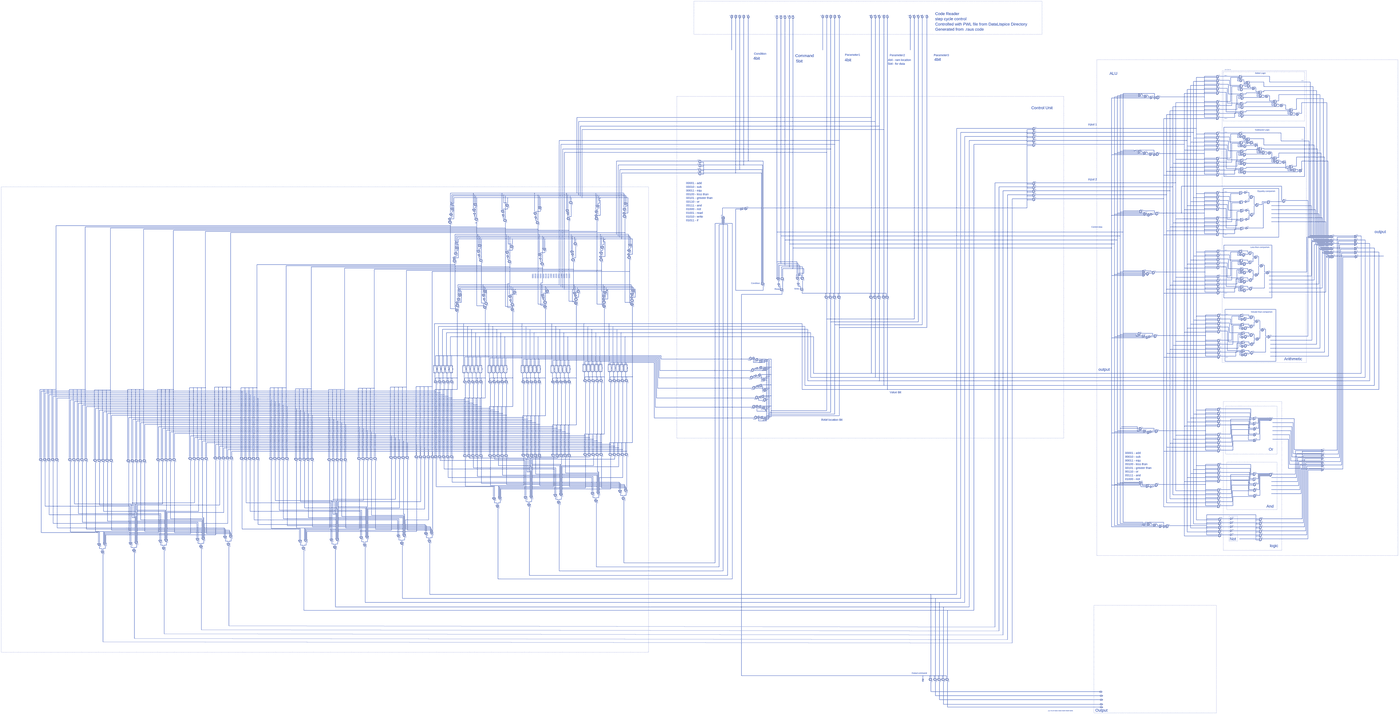
[diagram p0: schematic 4bit processor.asc, whole sheet]
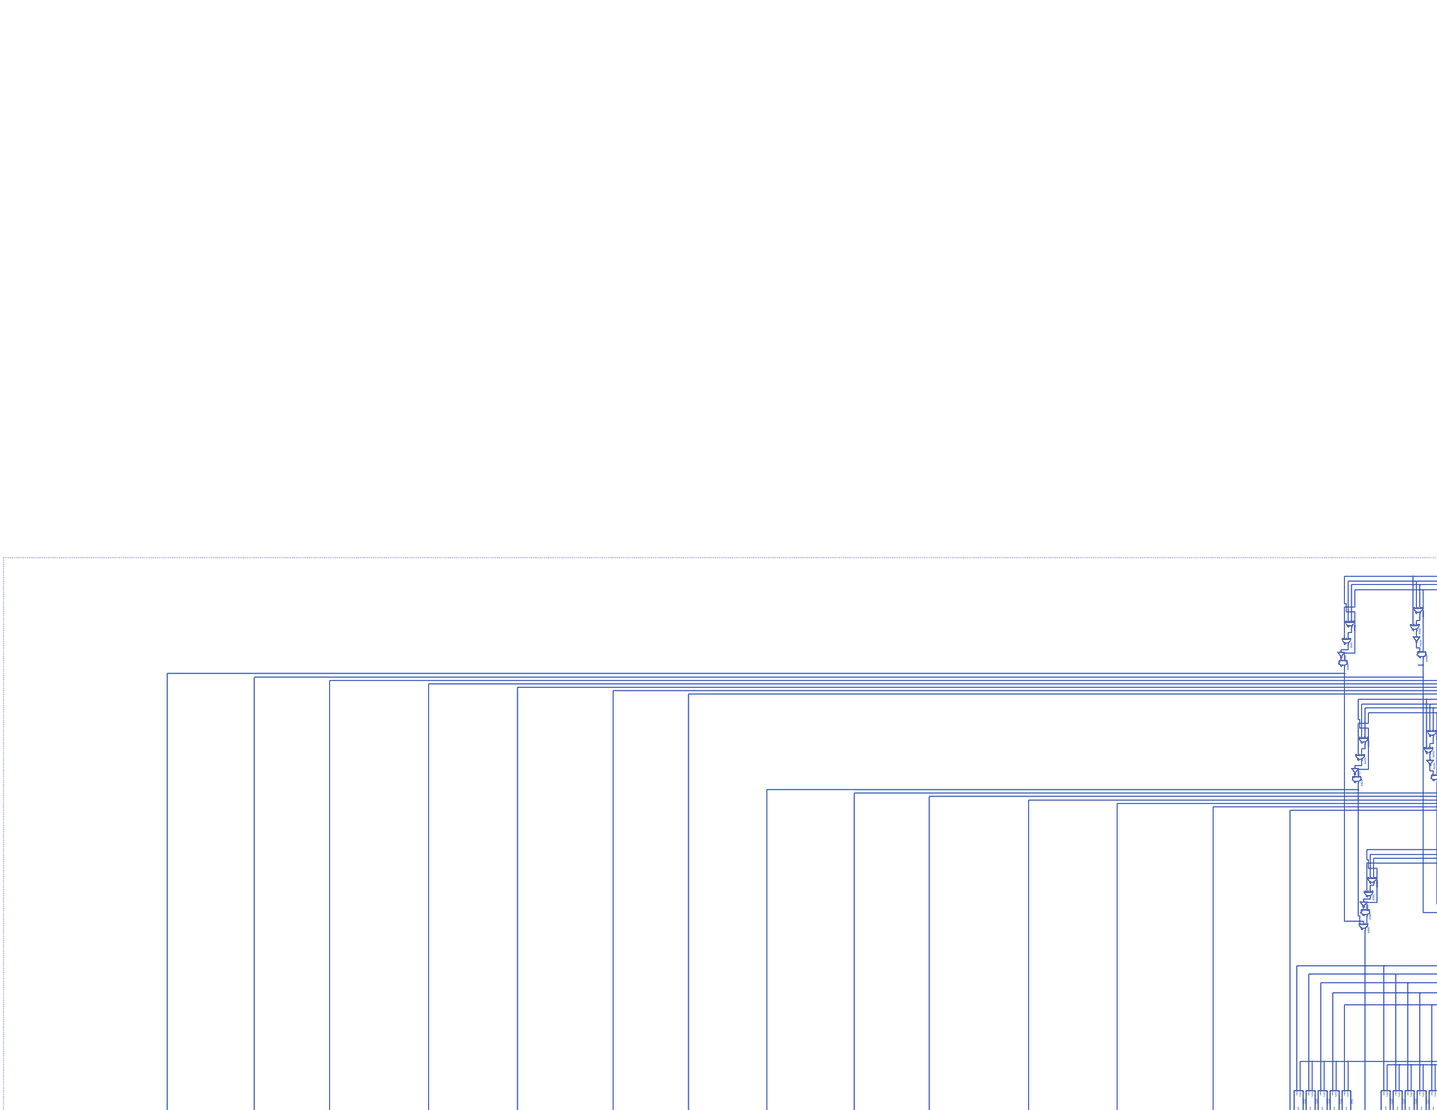
[diagram p1: schematic 4bit processor.asc, part, row 1 of 2, column 1 of 3]
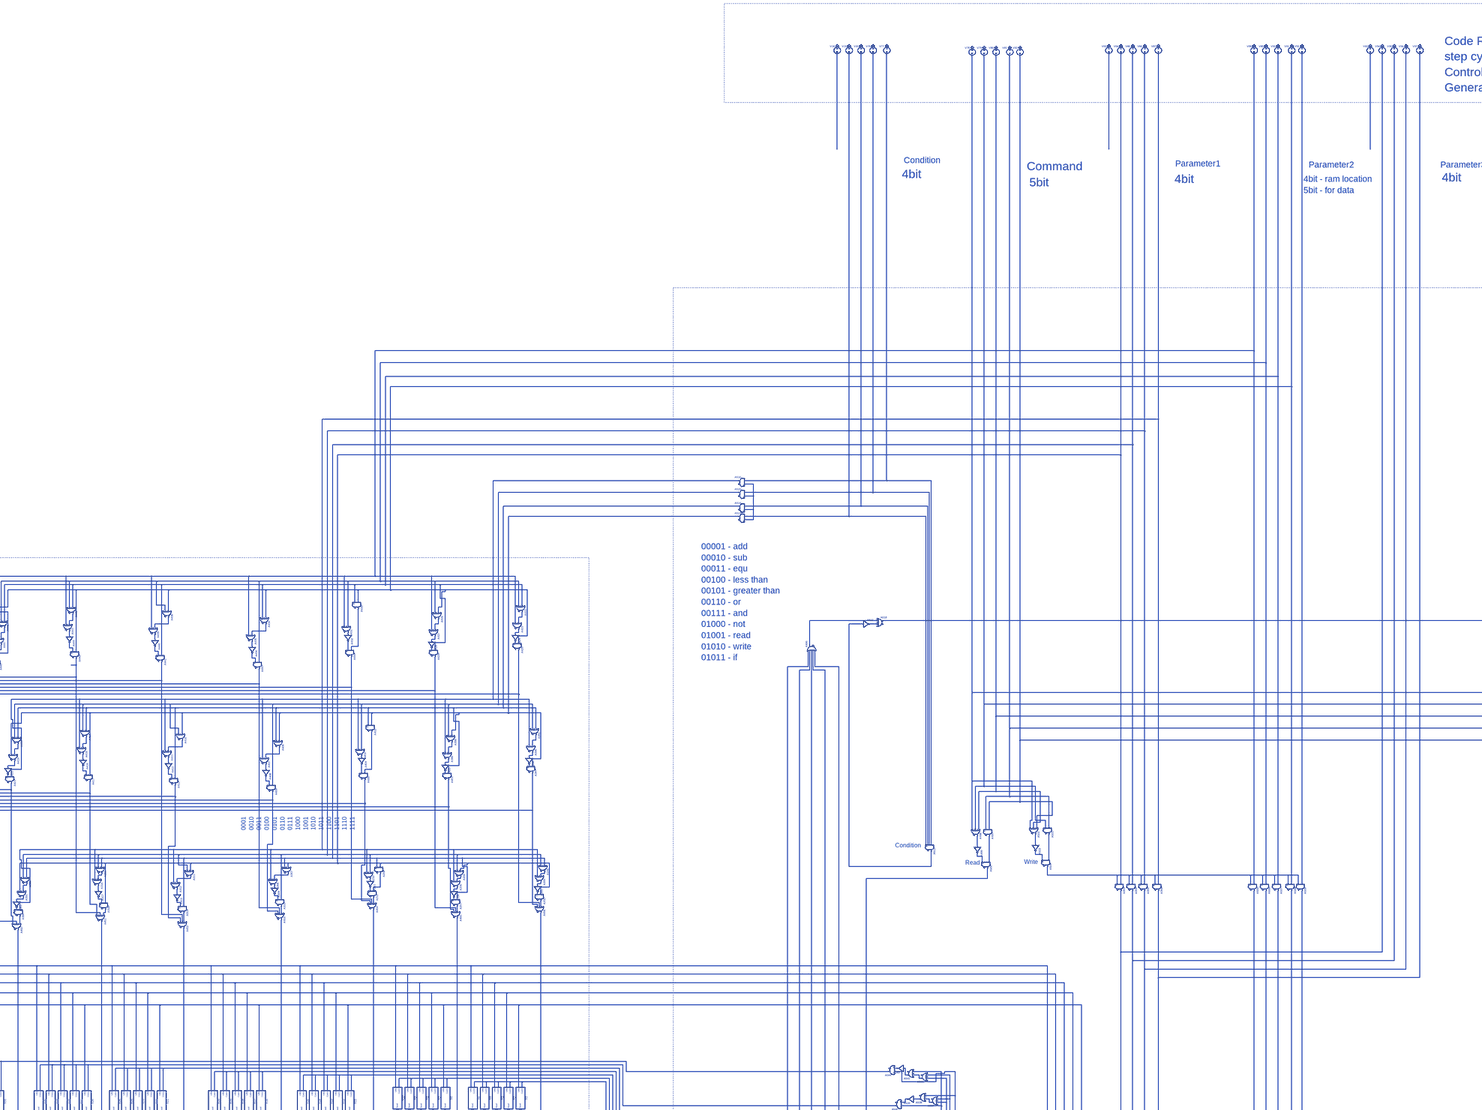
[diagram p2: schematic 4bit processor.asc, part, row 1 of 2, column 2 of 3]
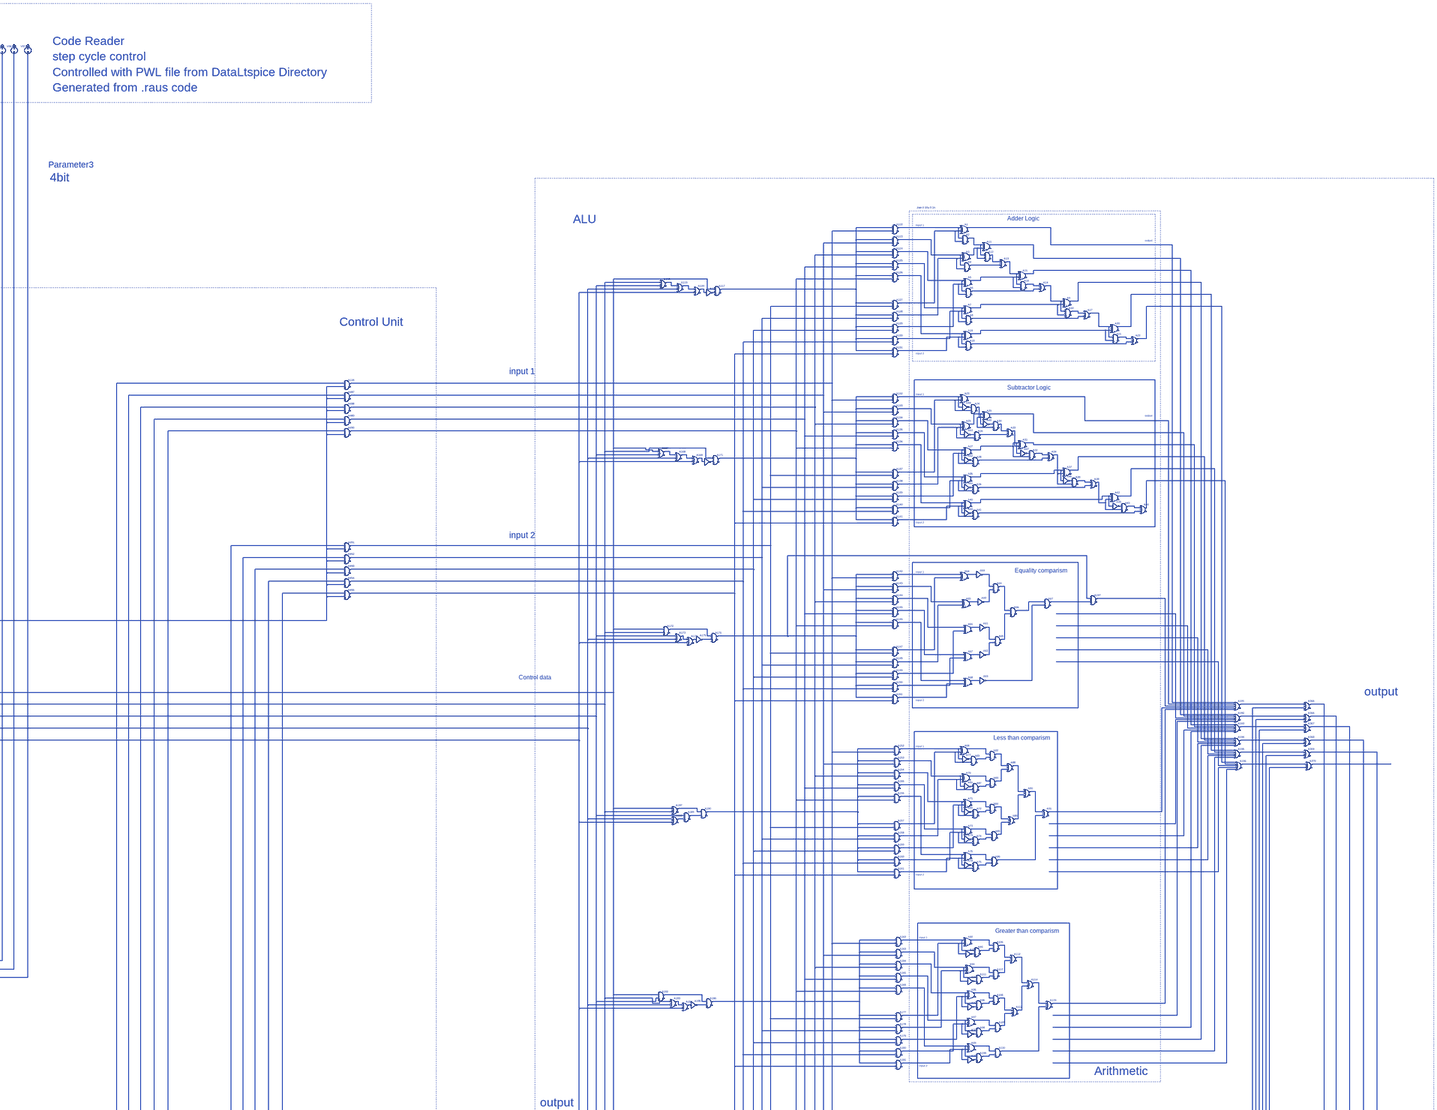
[diagram p3: schematic 4bit processor.asc, part, row 1 of 2, column 3 of 3]
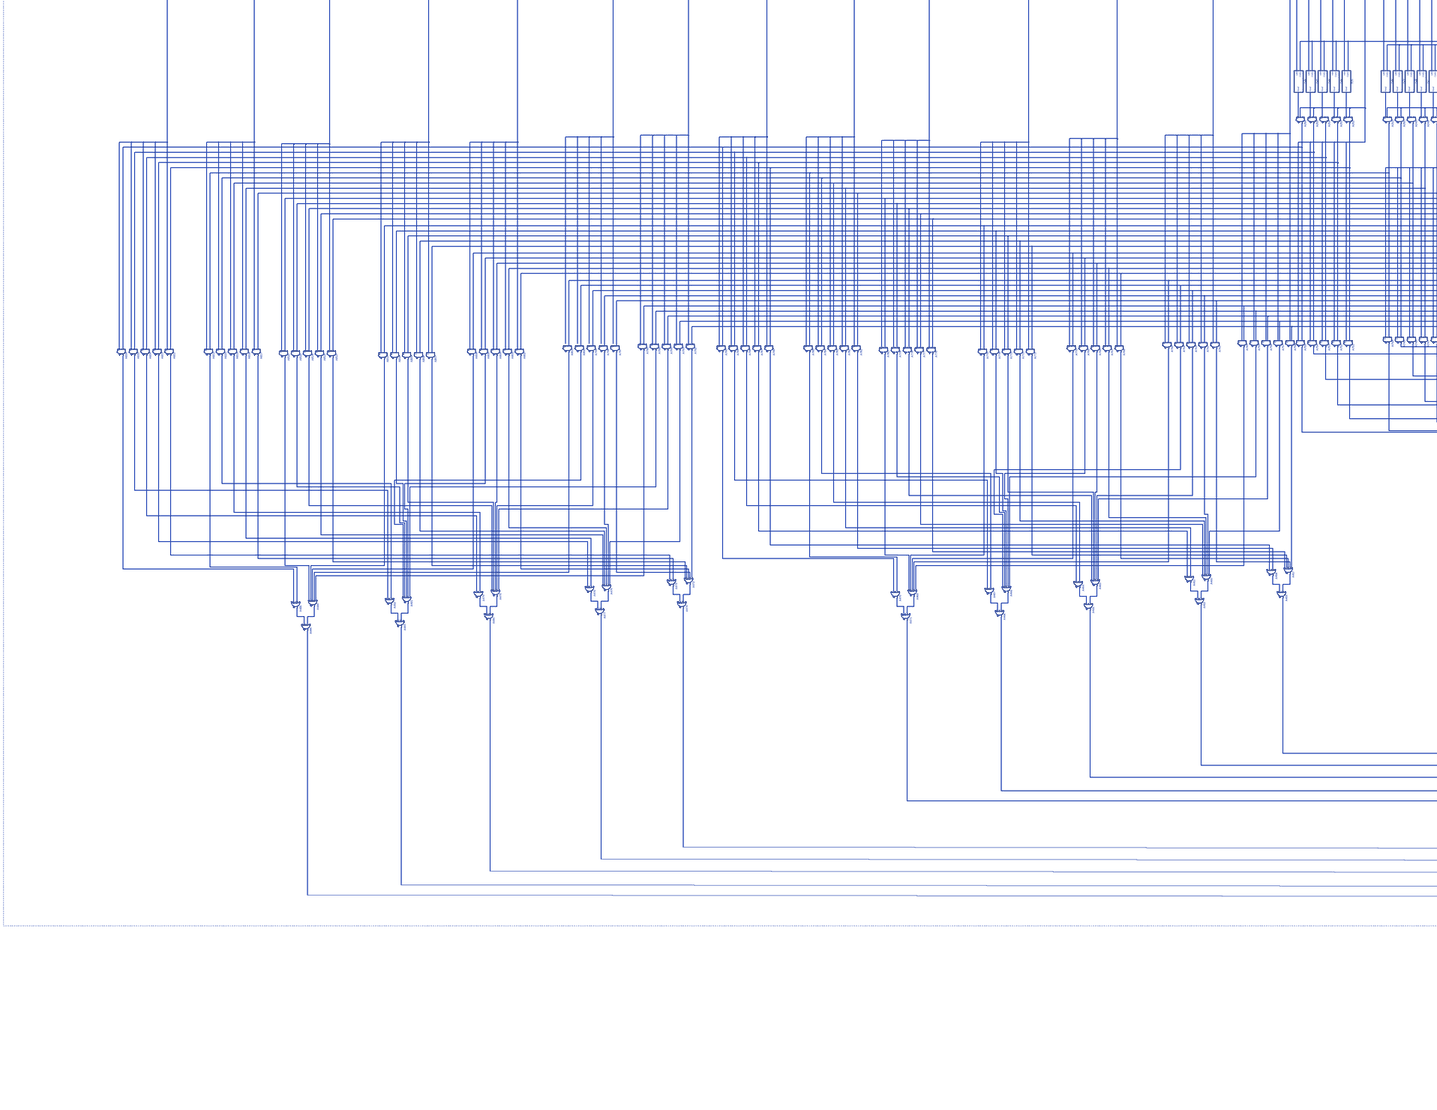
[diagram p4: schematic 4bit processor.asc, part, row 2 of 2, column 1 of 3]
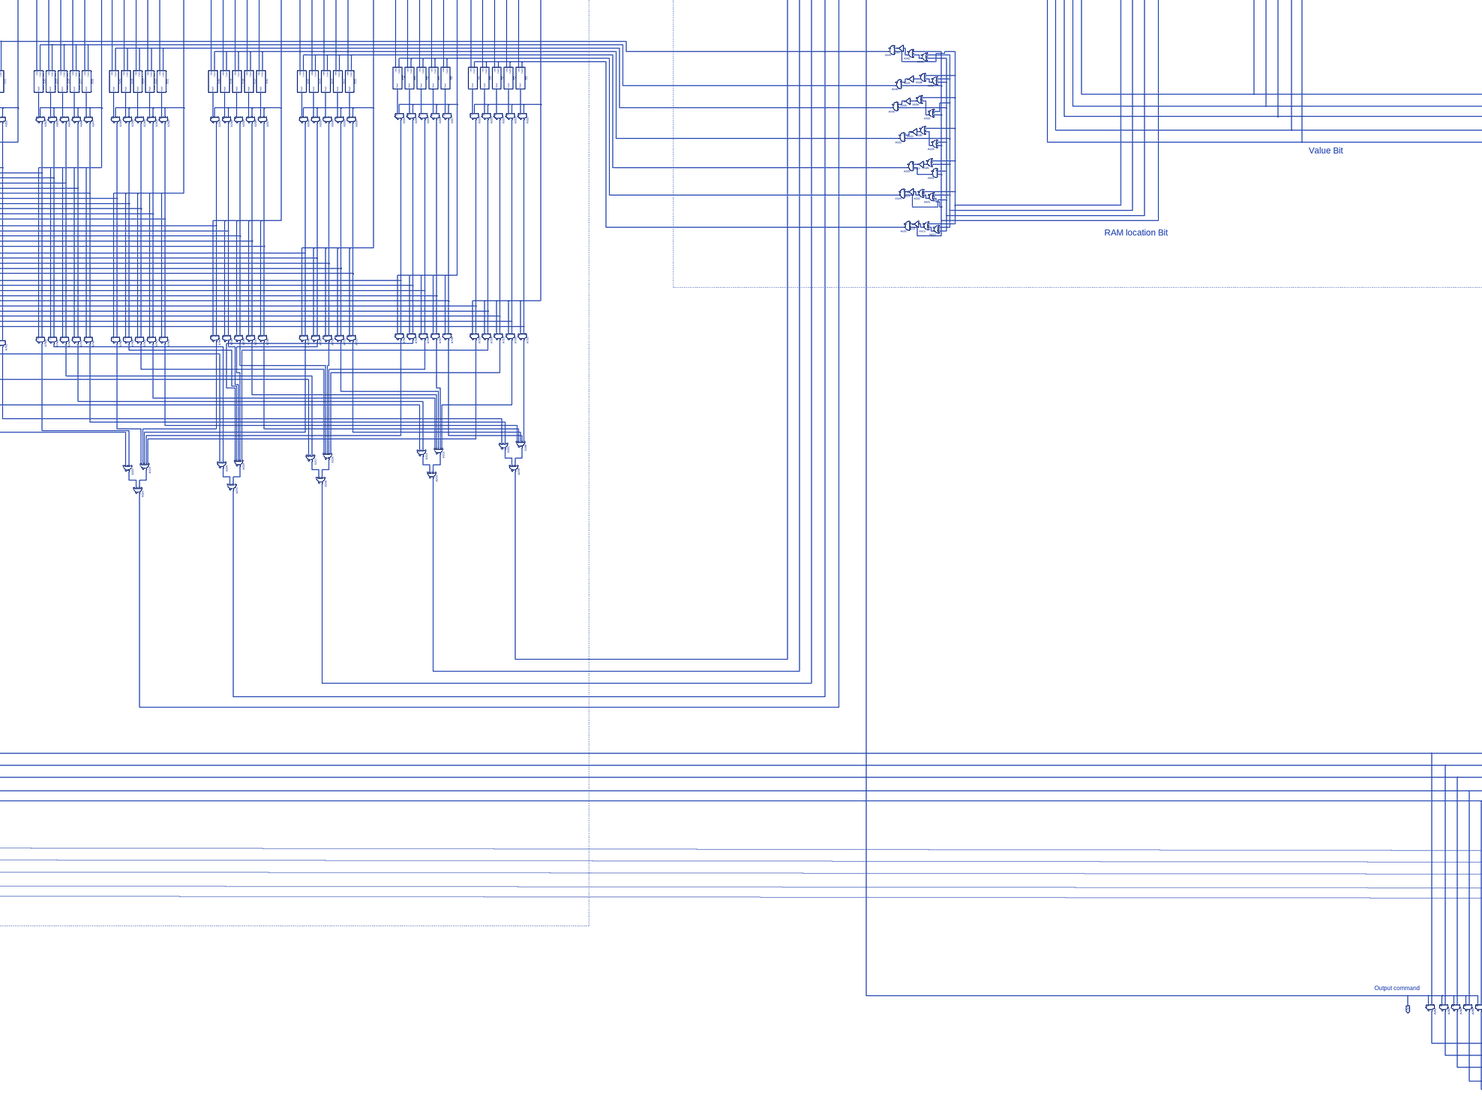
[diagram p5: schematic 4bit processor.asc, part, row 2 of 2, column 2 of 3]
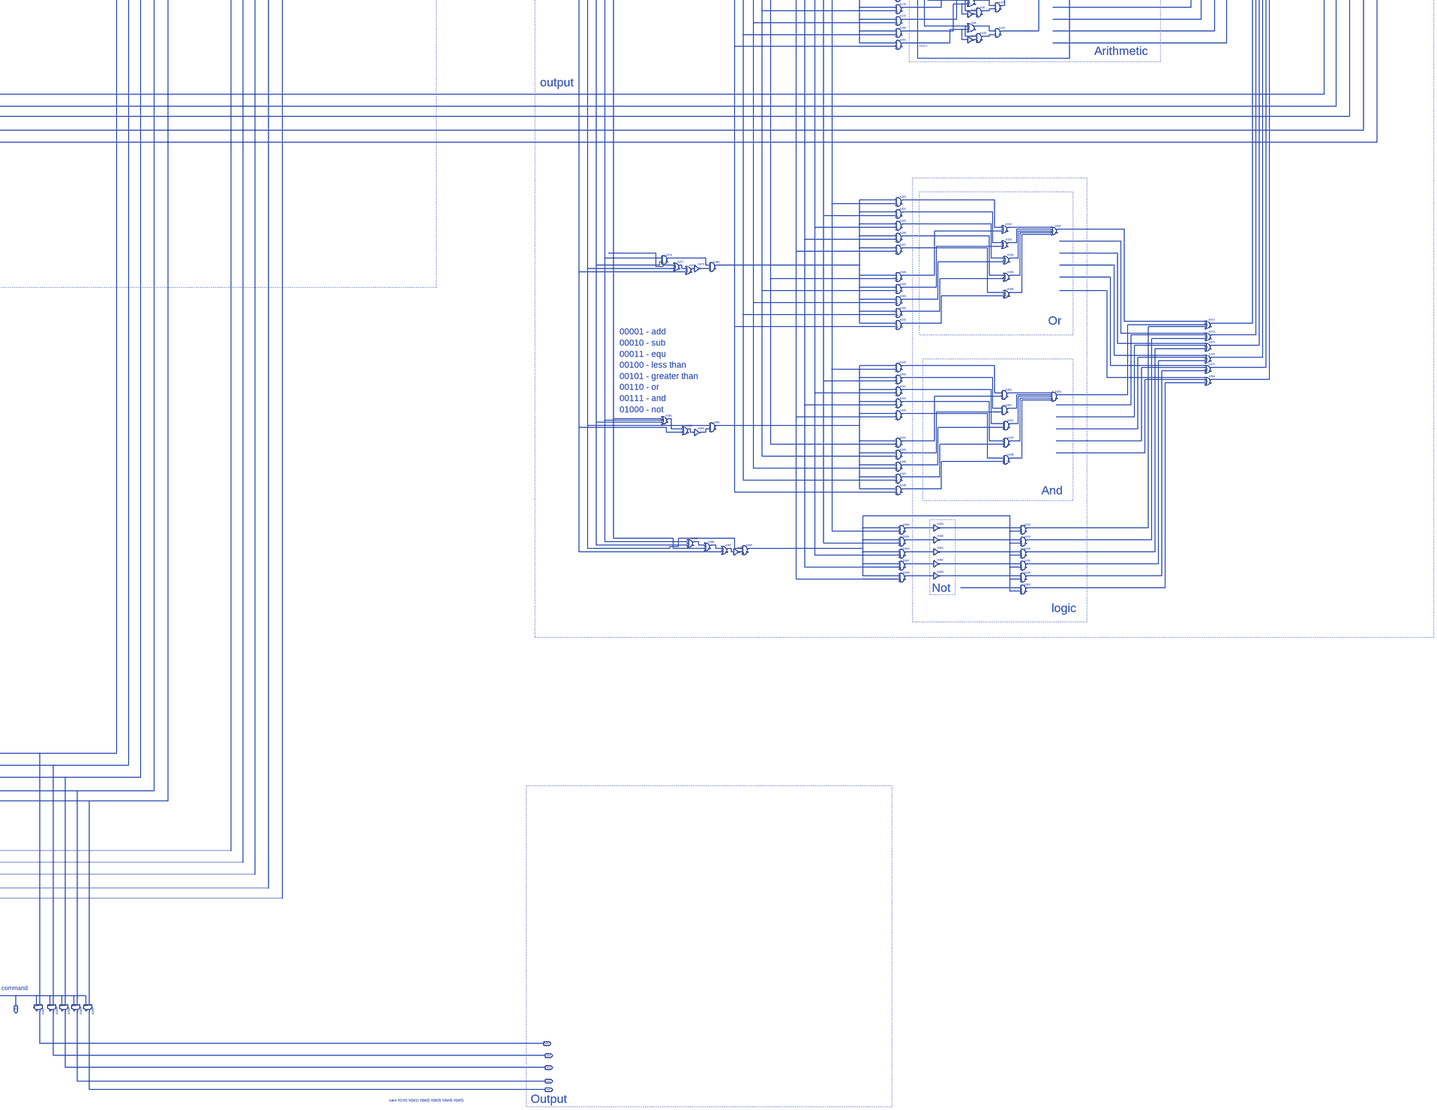
[diagram p6: schematic 4bit processor.asc, part, row 2 of 2, column 3 of 3]
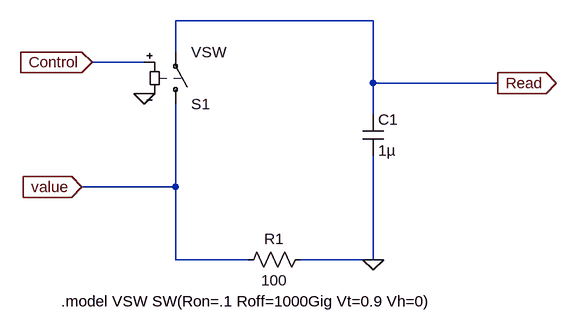
[diagram p7: sub-circuit ram_write_and_read_circuit.asc]
* 4bit processor.asc
A1 0 N005 0 N008 0 0 N006 0 XOR
A2 0 N005 0 N008 0 0 N009 0 AND
A3 0 N010 0 N017 0 0 N013 0 XOR
A4 0 N010 0 N017 0 0 N020 0 AND
A5 0 N014 0 N030 0 0 N024 0 XOR
A6 0 N014 0 N030 0 0 N037 0 AND
A11 0 N009 0 N013 0 0 N012 0 XOR
A12 0 N009 0 N013 0 0 N016 0 AND
A15 0 N018 0 N024 0 0 N022 0 XOR
A16 0 N018 0 N024 0 0 N031 0 AND
A13 0 N016 0 N020 0 0 N018 0 OR
A14 0 N031 0 N037 0 0 N034 0 OR
A7 0 N019 0 N044 0 0 N041 0 XOR
A8 0 N019 0 N044 0 0 N047 0 AND
A9 0 N034 0 N041 0 0 N029 0 XOR
A10 0 N034 0 N041 0 0 N045 0 AND
A17 0 N045 0 N047 0 0 N046 0 OR
A18 0 N023 0 N051 0 0 N050 0 XOR
A19 0 N023 0 N051 0 0 N054 0 AND
A20 0 N046 0 N050 0 0 N040 0 XOR
A21 0 N046 0 N050 0 0 N052 0 AND
A22 0 N052 0 N054 0 0 N043 0 OR
A23 0 N065 0 N067 0 0 N066 0 XOR
A24 0 N069 0 N067 0 0 N070 0 AND
A25 0 N071 0 N079 0 0 N072 0 XOR
A26 0 N084 0 N079 0 0 N085 0 AND
A27 0 N076 0 N091 0 0 N086 0 XOR
A28 0 N100 0 N091 0 0 N099 0 AND
A29 0 N072 0 N070 0 0 N073 0 XOR
A30 0 N077 0 N070 0 0 N078 0 AND
A31 0 N086 0 N082 0 0 N087 0 XOR
A32 0 N092 0 N086 0 0 N093 0 AND
A33 0 N078 0 N085 0 0 N082 0 OR
A34 0 N093 0 N099 0 0 N096 0 OR
A35 0 N083 0 N106 0 0 N103 0 XOR
A36 0 N113 0 N106 0 0 N112 0 AND
A37 0 N103 0 N096 0 0 N097 0 XOR
A38 0 N107 0 N096 0 0 N108 0 AND
A39 0 N108 0 N112 0 0 N110 0 OR
A40 0 N089 0 N119 0 0 N116 0 XOR
A41 0 N123 0 N119 0 0 N122 0 AND
A42 0 N116 0 N110 0 0 N102 0 XOR
A43 0 N120 0 N110 0 0 N121 0 AND
A44 0 N121 0 N122 0 0 N109 0 OR
A45 N116 0 0 0 0 N120 0 0 BUF
A46 N103 0 0 0 0 N107 0 0 BUF
A47 N086 0 0 0 0 N092 0 0 BUF
A48 N072 0 0 0 0 N077 0 0 BUF
A49 N065 0 0 0 0 N069 0 0 BUF
A50 N089 0 0 0 0 N123 0 0 BUF
A51 N083 0 0 0 0 N113 0 0 BUF
A52 N076 0 0 0 0 N100 0 0 BUF
A53 N071 0 0 0 0 N084 0 0 BUF
A54 0 N131 0 N134 0 0 N132 0 XOR
A55 0 N136 0 N145 0 0 N142 0 XOR
A56 0 N140 0 N163 0 0 N159 0 XOR
A57 0 N147 0 N186 0 0 N184 0 XOR
A58 0 N153 0 N198 0 0 N196 0 XOR
A59 N132 0 0 0 0 N133 0 0 BUF
A60 N142 0 0 0 0 N138 0 0 BUF
A61 N159 0 0 0 0 N160 0 0 BUF
A62 N184 0 0 0 0 N175 0 0 BUF
A63 N196 0 0 0 0 N146 0 0 BUF
A64 0 N133 0 N138 0 0 N137 0 AND
A65 0 N160 0 N175 0 0 N148 0 AND
A66 0 N137 0 N148 0 0 N143 0 AND
A67 0 N143 0 N146 0 0 N144 0 AND
A68 0 N229 0 N231 0 0 N230 0 XOR
A69 0 N243 0 N231 0 0 N240 0 AND
A70 0 N244 0 N265 0 0 N264 0 XOR
A71 0 N261 0 N279 0 0 N277 0 XOR
A72 0 N285 0 N279 0 0 N284 0 AND
A73 0 N267 0 N291 0 0 N290 0 XOR
A74 0 N293 0 N291 0 0 N292 0 AND
A75 0 N275 0 N299 0 0 N297 0 XOR
A76 0 N303 0 N299 0 0 N302 0 AND
A77 N229 0 0 0 0 N243 0 0 BUF
A78 N275 0 0 0 0 N303 0 0 BUF
A79 N267 0 0 0 0 N293 0 0 BUF
A80 N261 0 0 0 0 N285 0 0 BUF
A81 N244 0 0 0 0 N269 0 0 BUF
A82 0 N230 0 N240 0 0 N235 0 AND
A83 0 N264 0 N268 0 0 N256 0 AND
A84 0 N277 0 N284 0 0 N281 0 AND
A85 0 N290 0 N292 0 0 N289 0 AND
A86 0 N297 0 N302 0 0 N287 0 AND
A87 0 N269 0 N265 0 0 N268 0 AND
A88 0 N235 0 N256 0 0 N251 0 OR
A89 0 N281 0 N289 0 0 N273 0 OR
A90 0 N251 0 N273 0 0 N271 0 OR
A91 0 N271 0 N287 0 0 N204 0 OR
A92 0 N336 0 N338 0 0 N337 0 XOR
A93 0 N336 0 N343 0 0 N340 0 AND
A94 0 N342 0 N350 0 0 N348 0 XOR
A95 0 N347 0 N360 0 0 N358 0 XOR
A96 0 N347 0 N366 0 0 N363 0 AND
A97 0 N351 0 N370 0 0 N369 0 XOR
A98 0 N351 0 N372 0 0 N371 0 AND
A99 0 N357 0 N374 0 0 N373 0 XOR
A100 0 N357 0 N376 0 0 N375 0 AND
A101 N338 0 0 0 0 N343 0 0 BUF
A102 N374 0 0 0 0 N376 0 0 BUF
A103 N370 0 0 0 0 N372 0 0 BUF
A104 N360 0 0 0 0 N366 0 0 BUF
A105 N350 0 0 0 0 N354 0 0 BUF
A106 0 N337 0 N340 0 0 N339 0 AND
A107 0 N348 0 N352 0 0 N346 0 AND
A108 0 N358 0 N363 0 0 N361 0 AND
A109 0 N369 0 N371 0 0 N368 0 AND
A110 0 N373 0 N375 0 0 N367 0 AND
A111 0 N342 0 N354 0 0 N352 0 AND
A112 0 N339 0 N346 0 0 N344 0 OR
A113 0 N361 0 N368 0 0 N356 0 OR
A114 0 N344 0 N356 0 0 N355 0 OR
A115 0 N355 0 N367 0 0 N206 0 OR
A118 0 N027 0 N032 0 0 N028 0 OR
A119 0 N028 0 N035 0 0 N033 0 OR
A120 0 N033 0 N038 0 0 N036 0 OR
A121 N036 0 0 0 0 N039 0 0 BUF
A122 0 N004 0 N007 0 0 N005 0 AND
A117 0 N025 0 N039 0 0 N004 0 AND
A123 0 N004 0 N011 0 0 N010 0 AND
A124 0 N004 0 N015 0 0 N014 0 AND
A125 0 N004 0 N021 0 0 N019 0 AND
A126 0 N004 0 N026 0 0 N023 0 AND
A127 0 N004 0 N042 0 0 N008 0 AND
A128 0 N004 0 N048 0 0 N017 0 AND
A129 0 N004 0 N049 0 0 N030 0 AND
A130 0 N004 0 N053 0 0 N044 0 AND
A131 0 N004 0 N056 0 0 N051 0 AND
A132 0 N064 0 N007 0 0 N065 0 AND
A133 0 N064 0 N011 0 0 N071 0 AND
A134 0 N064 0 N015 0 0 N076 0 AND
A135 0 N064 0 N021 0 0 N083 0 AND
A136 0 N064 0 N026 0 0 N089 0 AND
A137 0 N064 0 N042 0 0 N067 0 AND
A138 0 N064 0 N048 0 0 N079 0 AND
A139 0 N064 0 N049 0 0 N091 0 AND
A140 0 N064 0 N053 0 0 N106 0 AND
A141 0 N064 0 N056 0 0 N119 0 AND
A142 0 N127 0 N007 0 0 N131 0 AND
A143 0 N127 0 N011 0 0 N136 0 AND
A144 0 N127 0 N015 0 0 N140 0 AND
A145 0 N127 0 N021 0 0 N147 0 AND
A146 0 N127 0 N026 0 0 N153 0 AND
A147 0 N127 0 N042 0 0 N134 0 AND
A148 0 N127 0 N048 0 0 N145 0 AND
A149 0 N127 0 N049 0 0 N163 0 AND
A150 0 N127 0 N053 0 0 N186 0 AND
A151 0 N127 0 N056 0 0 N198 0 AND
A152 0 N228 0 N007 0 0 N229 0 AND
A153 0 N228 0 N011 0 0 N244 0 AND
A154 0 N228 0 N015 0 0 N261 0 AND
A155 0 N228 0 N021 0 0 N267 0 AND
A156 0 N228 0 N026 0 0 N275 0 AND
A157 0 N228 0 N042 0 0 N231 0 AND
A158 0 N228 0 N048 0 0 N265 0 AND
A159 0 N228 0 N049 0 0 N279 0 AND
A160 0 N228 0 N053 0 0 N291 0 AND
A161 0 N228 0 N056 0 0 N299 0 AND
A162 0 N335 0 N007 0 0 N336 0 AND
A163 0 N335 0 N011 0 0 N342 0 AND
A164 0 N335 0 N015 0 0 N347 0 AND
A165 0 N335 0 N021 0 0 N351 0 AND
A166 0 N335 0 N026 0 0 N357 0 AND
A167 0 N025 0 N032 0 0 N090 0 OR
A168 0 N090 0 N035 0 0 N095 0 OR
A169 0 N095 0 N038 0 0 N098 0 OR
A170 N098 0 0 0 0 N101 0 0 BUF
A171 0 N027 0 N101 0 0 N064 0 AND
A172 0 N025 0 N027 0 0 N161 0 AND
A173 0 N032 0 N035 0 0 N168 0 OR
A174 0 N168 0 N038 0 0 N172 0 OR
A175 N172 0 0 0 0 N173 0 0 BUF
A176 0 N161 0 N173 0 0 N127 0 AND
A177 0 N335 0 N042 0 0 N338 0 AND
A178 0 N335 0 N048 0 0 N350 0 AND
A179 0 N335 0 N049 0 0 N360 0 AND
A180 0 N335 0 N053 0 0 N370 0 AND
A181 0 N335 0 N056 0 0 N374 0 AND
A182 0 N025 0 N032 0 0 N359 0 AND
A183 0 N027 0 N035 0 0 N362 0 OR
A184 0 N362 0 N038 0 0 N364 0 OR
A185 N364 0 0 0 0 N365 0 0 BUF
A186 0 N359 0 N365 0 0 N335 0 AND
A187 0 N025 0 N027 0 0 N282 0 OR
A188 0 N035 0 N038 0 0 N288 0 OR
A189 0 N032 0 N288 0 0 N286 0 AND
A190 0 N282 0 N286 0 0 N228 0 AND
A191 N006 N066 N141 N204 N206 0 N202 0 OR
A192 N012 N073 N149 N209 N211 0 N207 0 OR
A193 N022 N087 N158 N214 N217 0 N212 0 OR
A194 N029 N097 N169 N222 N224 0 N219 0 OR
A195 N040 N102 N182 N237 N241 0 N232 0 OR
A196 N043 N109 N188 N252 N257 0 N247 0 OR
A197 0 N127 0 N144 0 0 N141 0 AND
A199 0 N088 0 N080 0 0 N304 0 OR
A200 0 N304 0 N074 0 0 N311 0 OR
A201 N311 0 0 0 0 N320 0 0 BUF
A202 0 N094 0 N320 0 0 N327 0 AND
A204 0 N094 0 N080 0 0 N309 0 OR
A205 0 N309 0 N074 0 0 N316 0 OR
A206 N316 0 0 0 0 N324 0 0 BUF
A207 0 N088 0 N324 0 0 N329 0 AND
A208 0 N094 0 N088 0 0 N315 0 AND
A210 0 N080 0 N074 0 0 N310 0 OR
A211 N310 0 0 0 0 N318 0 0 BUF
A212 0 N315 0 N318 0 0 N326 0 AND
A222 0 N394 0 N409 0 0 N508 0 AND
A223 0 N394 0 N408 0 0 N506 0 AND
A224 0 0 0 N407 0 0 N505 0 AND
A225 0 N394 0 N406 0 0 N504 0 AND
A226 0 0 N394 N405 0 0 N503 0 AND
A227 0 N393 0 N404 0 0 N502 0 AND
A228 0 N393 0 N403 0 0 N500 0 AND
A229 0 0 0 N402 0 0 N498 0 AND
A230 0 N393 0 N401 0 0 N497 0 AND
A231 0 0 N393 N400 0 0 N496 0 AND
A232 0 N399 0 N434 0 0 N493 0 AND
A233 0 N399 0 N433 0 0 N490 0 AND
A234 0 0 0 N432 0 0 N487 0 AND
A235 0 N399 0 N431 0 0 N484 0 AND
A236 0 0 N399 N430 0 0 N482 0 AND
A237 0 N398 0 N429 0 0 N479 0 AND
A238 0 N398 0 N428 0 0 N477 0 AND
A239 0 0 0 N427 0 0 N475 0 AND
A240 0 N398 0 N426 0 0 N470 0 AND
A241 0 0 N398 N425 0 0 N465 0 AND
A242 0 N397 0 N424 0 0 N461 0 AND
A243 0 N397 0 N423 0 0 N460 0 AND
A244 0 0 0 N422 0 0 N458 0 AND
A245 0 N397 0 N421 0 0 N457 0 AND
A246 0 0 N397 N420 0 0 N454 0 AND
A247 0 N396 0 N419 0 0 N452 0 AND
A248 0 N396 0 N418 0 0 N449 0 AND
A249 0 0 0 N417 0 0 N448 0 AND
A250 0 N396 0 N416 0 0 N447 0 AND
A251 0 0 N396 N415 0 0 N446 0 AND
A252 0 N395 0 N414 0 0 N444 0 AND
A253 0 N395 0 N413 0 0 N441 0 AND
A254 0 0 0 N412 0 0 N440 0 AND
A255 0 N395 0 N411 0 0 N439 0 AND
A256 0 0 N395 N410 0 0 N438 0 AND
A307 0 N094 0 N088 0 0 N306 0 OR
A308 0 N306 0 N074 0 0 N314 0 OR
A309 N314 0 0 0 0 N321 0 0 BUF
A310 0 N080 0 N321 0 0 N331 0 AND
A311 0 N094 0 N080 0 0 N308 0 OR
A312 0 N308 0 N074 0 0 N319 0 OR
A313 N319 0 0 0 0 N325 0 0 BUF
A314 0 N088 0 N325 0 0 N332 0 AND
A315 0 N088 0 N080 0 0 N305 0 OR
A316 0 N305 0 N074 0 0 N317 0 OR
A317 N317 0 0 0 0 N323 0 0 BUF
A318 0 N094 0 N323 0 0 N330 0 AND
A198 N571 N569 N567 N561 N557 0 N574 0 OR
A203 0 N556 0 N554 0 0 N573 0 OR
A209 0 N574 0 N573 0 0 N190 0 OR
A213 N551 N537 N539 N541 N545 0 N577 0 OR
A214 0 N548 0 N550 0 0 N576 0 OR
A215 0 N577 0 N576 0 0 N192 0 OR
A216 N531 N529 N524 N523 N528 0 N580 0 OR
A217 0 N532 0 N534 0 0 N579 0 OR
A218 0 N580 0 N579 0 0 N690 0 OR
A219 N519 N516 N515 N518 N512 0 N587 0 OR
A220 0 N514 0 N520 0 0 N586 0 OR
A221 0 N587 0 N586 0 0 N193 0 OR
A319 N570 N568 N566 N560 N559 0 N591 0 OR
A320 0 N564 0 N565 0 0 N590 0 OR
A321 0 N591 0 N590 0 0 N191 0 OR
A322 0 N456 0 N471 0 0 N467 0 OR
A323 0 N455 0 N007 0 0 N456 0 AND
A324 0 N455 0 N011 0 0 N459 0 AND
A325 0 N455 0 N015 0 0 N464 0 AND
A326 0 N455 0 N021 0 0 N476 0 AND
A327 0 N455 0 N026 0 0 N481 0 AND
A328 0 N455 0 N042 0 0 N471 0 AND
A329 0 N455 0 N048 0 0 N480 0 AND
A330 0 N455 0 N049 0 0 N486 0 AND
A331 0 N455 0 N053 0 0 N495 0 AND
A332 0 N455 0 N056 0 0 N501 0 AND
A333 0 N459 0 N480 0 0 N468 0 OR
A334 0 N464 0 N486 0 0 N472 0 OR
A335 0 N476 0 N495 0 0 N473 0 OR
A336 0 N481 0 N501 0 0 N474 0 OR
A337 N467 N468 N472 N473 N474 0 N469 0 OR
A339 0 N525 0 N007 0 0 N526 0 AND
A340 0 N525 0 N011 0 0 N533 0 AND
A341 0 N525 0 N015 0 0 N538 0 AND
A342 0 N525 0 N021 0 0 N549 0 AND
A343 0 N525 0 N026 0 0 N553 0 AND
A344 0 N525 0 N042 0 0 N543 0 AND
A345 0 N525 0 N048 0 0 N552 0 AND
A346 0 N525 0 N049 0 0 N558 0 AND
A347 0 N525 0 N053 0 0 N572 0 AND
A348 0 N525 0 N056 0 0 N575 0 AND
A354 0 N613 0 N007 0 0 N620 0 AND
A355 0 N613 0 N011 0 0 N627 0 AND
A356 0 N613 0 N015 0 0 N638 0 AND
A357 0 N613 0 N021 0 0 N652 0 AND
A358 0 N613 0 N026 0 0 N666 0 AND
A359 N620 0 0 0 0 N621 0 0 BUF
A360 N627 0 0 0 0 N628 0 0 BUF
A361 N638 0 0 0 0 N639 0 0 BUF
A362 N652 0 0 0 0 N653 0 0 BUF
A363 N666 0 0 0 0 N667 0 0 BUF
A338 0 N553 0 N575 0 0 N547 0 AND
A349 0 N549 0 N572 0 0 N546 0 AND
A350 0 N538 0 N558 0 0 N544 0 AND
A351 0 N533 0 N552 0 0 N542 0 AND
A352 0 N526 0 N543 0 0 N540 0 AND
A353 N540 N542 N544 N546 N547 0 N507 0 AND
A365 0 N202 0 N205 0 0 N203 0 OR
A366 0 N207 0 N210 0 0 N208 0 OR
A367 0 N212 0 N215 0 0 N213 0 OR
A368 0 N219 0 N223 0 0 N220 0 OR
A369 0 N232 0 N238 0 0 N233 0 OR
A370 0 N247 0 N253 0 0 N248 0 OR
A371 N469 0 N507 N509 0 0 N205 0 OR
A372 N478 N510 0 N511 0 0 N210 0 OR
A373 N483 N513 0 N517 0 0 N215 0 OR
A374 N489 N521 0 N522 0 0 N223 0 OR
A375 N494 N527 0 N530 0 0 N238 0 OR
A364 N499 N535 0 N536 0 0 N253 0 OR
A376 0 N027 0 N032 0 0 N485 0 AND
A377 0 N025 0 N035 0 0 N488 0 OR
A378 0 N488 0 N038 0 0 N491 0 OR
A379 N491 0 0 0 0 N492 0 0 BUF
A380 0 N485 0 N492 0 0 N455 0 AND
A382 0 N555 0 N038 0 0 N562 0 OR
A384 N562 0 0 0 0 N563 0 0 BUF
A385 0 N035 0 N563 0 0 N525 0 AND
A381 0 N025 N027 N032 0 0 N555 0 OR
A383 0 N027 0 N032 0 0 N631 0 OR
A386 0 N631 0 N025 0 0 N633 0 OR
A387 0 N633 0 N038 0 0 N635 0 OR
A388 N635 0 0 0 0 N637 0 0 BUF
A389 0 N035 0 N637 0 0 N613 0 AND
A390 0 N088 0 N080 0 0 N313 0 OR
A391 0 N313 0 N094 0 0 N322 0 OR
A393 N322 0 0 0 0 N328 0 0 BUF
A394 0 N074 0 N328 0 0 N333 0 AND
A392 0 N117 0 N114 0 0 N218 0 OR
A395 0 N218 0 N104 0 0 N236 0 OR
A396 N236 0 0 0 0 N250 0 0 BUF
A397 0 N124 0 N250 0 0 N283 0 AND
A398 0 N124 0 N114 0 0 N226 0 OR
A399 0 N226 0 N104 0 0 N246 0 OR
A400 N246 0 0 0 0 N260 0 0 BUF
A401 0 N117 0 N260 0 0 N280 0 AND
A402 0 N124 0 N117 0 0 N255 0 AND
A403 0 N114 0 N104 0 0 N239 0 OR
A404 N239 0 0 0 0 N259 0 0 BUF
A405 0 N255 0 N259 0 0 N278 0 AND
A406 0 N124 0 N117 0 0 N234 0 OR
A407 0 N234 0 N104 0 0 N254 0 OR
A408 N254 0 0 0 0 N266 0 0 BUF
A409 0 N114 0 N266 0 0 N276 0 AND
A410 0 N124 0 N114 0 0 N225 0 OR
A411 0 N225 0 N104 0 0 N245 0 OR
A412 N245 0 0 0 0 N262 0 0 BUF
A413 0 N117 0 N262 0 0 N274 0 AND
A414 0 N117 0 N114 0 0 N221 0 OR
A415 0 N221 0 N104 0 0 N242 0 OR
A416 N242 0 0 0 0 N258 0 0 BUF
A417 0 N124 0 N258 0 0 N272 0 AND
A418 0 N117 0 N114 0 0 N227 0 OR
A419 0 N227 0 N124 0 0 N249 0 OR
A420 N249 0 0 0 0 N263 0 0 BUF
A421 0 N104 0 N263 0 0 N270 0 AND
A422 0 N058 0 N057 0 0 N150 0 OR
A423 0 N150 0 N055 0 0 N165 0 OR
A424 N165 0 0 0 0 N174 0 0 BUF
A425 0 N061 0 N174 0 0 N201 0 AND
A426 0 N061 0 N057 0 0 N155 0 OR
A427 0 N155 0 N055 0 0 N171 0 OR
A428 N171 0 0 0 0 N181 0 0 BUF
A429 0 N058 0 N181 0 0 N200 0 AND
A430 0 N061 0 N058 0 0 N177 0 AND
A431 0 N057 0 N055 0 0 N166 0 OR
A432 N166 0 0 0 0 N180 0 0 BUF
A433 0 N177 0 N180 0 0 N199 0 AND
A434 0 N061 0 N058 0 0 N162 0 OR
A435 0 N162 0 N055 0 0 N176 0 OR
A436 N176 0 0 0 0 N185 0 0 BUF
A437 0 N057 0 N185 0 0 N197 0 AND
A438 0 N061 0 N057 0 0 N154 0 OR
A439 0 N154 0 N055 0 0 N170 0 OR
A440 N170 0 0 0 0 N183 0 0 BUF
A441 0 N058 0 N183 0 0 N195 0 AND
A442 0 N058 0 N057 0 0 N151 0 OR
A443 0 N151 0 N055 0 0 N167 0 OR
A444 N167 0 0 0 0 N178 0 0 BUF
A445 0 N061 0 N178 0 0 N189 0 AND
A446 0 N058 0 N057 0 0 N164 0 OR
A447 0 N164 0 N061 0 0 N179 0 OR
A448 N179 0 0 0 0 N187 0 0 BUF
A449 0 N055 0 N187 0 0 N194 0 AND
A450 N333 0 N194 0 N270 0 N395 0 OR
A451 N330 0 N189 0 N272 0 N396 0 OR
A452 0 N332 N195 N274 0 0 N397 0 OR
A453 0 N331 N197 N276 0 0 N398 0 OR
A454 0 N326 N199 N278 0 0 N399 0 OR
A455 0 N329 N200 N280 0 0 N393 0 OR
A456 0 N327 N201 N283 0 0 N394 0 OR
A457 N659 N651 N648 N643 N636 0 N670 0 OR
A458 0 N634 0 N632 0 0 N669 0 OR
A459 0 N670 0 N669 0 0 N060 0 OR
A460 N624 N611 N614 N615 N617 0 N673 0 OR
A461 0 N619 0 N623 0 0 N672 0 OR
A462 0 N673 0 N672 0 0 N063 0 OR
A463 N602 N601 N599 N598 N600 0 N677 0 OR
A464 0 N605 0 N608 0 0 N676 0 OR
A465 0 N677 0 N676 0 0 N068 0 OR
A466 N585 N583 N582 N584 N578 0 N681 0 OR
A467 0 N581 0 N589 0 0 N680 0 OR
A468 0 N681 0 N680 0 0 N075 0 OR
A469 N657 N650 N647 N642 N641 0 N685 0 OR
A470 0 N644 0 N646 0 0 N684 0 OR
A471 0 N685 0 N684 0 0 N081 0 OR
A472 N668 N664 N662 N656 N649 0 N675 0 OR
A473 0 N645 0 N640 0 0 N674 0 OR
A474 0 N675 0 N674 0 0 N126 0 OR
A475 N630 N616 N618 N622 N625 0 N679 0 OR
A476 0 N626 0 N629 0 0 N678 0 OR
A477 0 N679 0 N678 0 0 N128 0 OR
A478 N609 N607 N604 N603 N606 0 N683 0 OR
A479 0 N610 0 N612 0 0 N682 0 OR
A480 0 N683 0 N682 0 0 N130 0 OR
A481 N596 N594 N593 N595 N588 0 N687 0 OR
A482 0 N592 0 N597 0 0 N686 0 OR
A483 0 N687 0 N686 0 0 N135 0 OR
A484 N665 N663 N661 N655 N654 0 N689 0 OR
A485 0 N658 0 N660 0 0 N688 0 OR
A486 0 N689 0 N688 0 0 N139 0 OR
A721 0 N508 0 N394 0 0 N571 0 AND
A722 0 N506 0 N394 0 0 N551 0 AND
A723 0 N505 0 N394 0 0 N531 0 AND
A724 0 N504 0 N394 0 0 N519 0 AND
A725 0 N503 0 N394 0 0 N570 0 AND
A726 0 N502 0 N393 0 0 N569 0 AND
A727 0 N500 0 N393 0 0 N537 0 AND
A728 0 N498 0 N393 0 0 N529 0 AND
A729 0 N497 0 N393 0 0 N512 0 AND
A730 0 N496 0 N393 0 0 N568 0 AND
A731 0 N493 0 N399 0 0 N567 0 AND
A732 0 N490 0 N399 0 0 N539 0 AND
A733 0 N487 0 N399 0 0 N524 0 AND
A734 0 N484 0 N399 0 0 N516 0 AND
A735 0 N482 0 N399 0 0 N566 0 AND
A736 0 N479 0 N398 0 0 N561 0 AND
A737 0 N477 0 N398 0 0 N541 0 AND
A738 0 N475 0 N398 0 0 N523 0 AND
A739 0 N470 0 N398 0 0 N515 0 AND
A740 0 N465 0 N398 0 0 N560 0 AND
A741 0 N461 0 N397 0 0 N557 0 AND
A742 0 N460 0 N397 0 0 N545 0 AND
A743 0 N458 0 N397 0 0 N528 0 AND
A744 0 N457 0 N397 0 0 N518 0 AND
A745 0 N454 0 N397 0 0 N559 0 AND
A746 0 N452 0 N396 0 0 N556 0 AND
A747 0 N449 0 N396 0 0 N548 0 AND
A748 0 N448 0 N396 0 0 N532 0 AND
A749 0 N447 0 N396 0 0 N514 0 AND
A750 0 N446 0 N396 0 0 N564 0 AND
A751 0 N444 0 N395 0 0 N554 0 AND
A752 0 N441 0 N395 0 0 N550 0 AND
A753 0 N440 0 N395 0 0 N534 0 AND
A754 0 N439 0 N395 0 0 N520 0 AND
A755 0 N438 0 N395 0 0 N565 0 AND
A756 0 N508 N283 0 0 0 N659 0 AND
A757 0 N506 N283 0 0 0 N624 0 AND
A758 0 N505 N283 0 0 0 N602 0 AND
A759 0 N504 N283 0 0 0 N585 0 AND
A760 0 N503 N283 0 0 0 N657 0 AND
A761 0 N502 0 N280 0 0 N651 0 AND
A762 0 N500 0 N280 0 0 N611 0 AND
A763 0 N498 0 N280 0 0 N601 0 AND
A764 0 N497 0 N280 0 0 N578 0 AND
A765 0 N496 0 N280 0 0 N650 0 AND
A766 0 N493 0 N278 0 0 N648 0 AND
A767 0 N490 0 N278 0 0 N614 0 AND
A768 0 N487 0 N278 0 0 N599 0 AND
A769 0 N484 0 N278 0 0 N583 0 AND
A770 0 N482 0 N278 0 0 N647 0 AND
A771 0 N479 0 N276 0 0 N643 0 AND
A772 0 N477 0 N276 0 0 N615 0 AND
A773 0 N475 0 N276 0 0 N598 0 AND
A774 0 N470 0 N276 0 0 N582 0 AND
A775 0 N465 0 N276 0 0 N642 0 AND
A776 0 N461 0 N274 0 0 N636 0 AND
A777 0 N460 0 N274 0 0 N617 0 AND
A778 0 N458 0 N274 0 0 N600 0 AND
A779 0 N457 0 N274 0 0 N584 0 AND
A780 0 N454 0 N274 0 0 N641 0 AND
A781 0 N452 0 N272 0 0 N634 0 AND
A782 0 N449 0 N272 0 0 N619 0 AND
A783 0 N448 0 N272 0 0 N605 0 AND
A784 0 N447 0 N272 0 0 N581 0 AND
A785 0 N446 0 N272 0 0 N644 0 AND
A786 0 N444 0 N270 0 0 N632 0 AND
A787 0 N441 0 N270 0 0 N623 0 AND
A788 0 N440 0 N270 0 0 N608 0 AND
A789 0 N439 0 N270 0 0 N589 0 AND
A790 0 N438 0 N270 0 0 N646 0 AND
A792 0 N508 0 N201 0 0 N668 0 AND
A793 0 N506 0 N201 0 0 N630 0 AND
A794 0 N505 0 N201 0 0 N609 0 AND
A795 0 N504 0 N201 0 0 N596 0 AND
A796 0 N503 0 N201 0 0 N665 0 AND
A797 0 N502 0 0 0 0 N664 0 AND
A798 0 N500 0 0 0 0 N616 0 AND
A799 0 N498 0 0 0 0 N607 0 AND
A800 0 N497 0 0 0 0 N588 0 AND
A801 0 N496 0 0 0 0 N663 0 AND
A802 0 N493 0 N199 0 0 N662 0 AND
A803 0 N490 0 N199 0 0 N618 0 AND
A804 0 N487 0 N199 0 0 N604 0 AND
A805 0 N484 0 N199 0 0 N594 0 AND
A806 0 N482 0 N199 0 0 N661 0 AND
A807 0 N479 0 N197 0 0 N656 0 AND
A808 0 N477 0 N197 0 0 N622 0 AND
A809 0 N475 0 N197 0 0 N603 0 AND
A810 0 N470 0 N197 0 0 N593 0 AND
A811 0 N465 0 N197 0 0 N655 0 AND
A812 0 N461 0 N195 0 0 N649 0 AND
A813 0 N460 0 N195 0 0 N625 0 AND
A814 0 N458 0 N195 0 0 N606 0 AND
A815 0 N457 0 N195 0 0 N595 0 AND
A816 0 N454 0 N195 0 0 N654 0 AND
A817 0 N452 0 N189 0 0 N645 0 AND
A818 0 N449 0 N189 0 0 N626 0 AND
A819 0 N448 0 N189 0 0 N610 0 AND
A820 0 N447 0 N189 0 0 N592 0 AND
A821 0 N446 0 N189 0 0 N658 0 AND
A822 0 N444 0 N194 0 0 N640 0 AND
A823 0 N441 0 N194 0 0 N629 0 AND
A824 0 N440 0 N194 0 0 N612 0 AND
A825 0 N439 0 N194 0 0 N597 0 AND
A826 0 N438 0 N194 0 0 N660 0 AND
A116 0 N060 0 N062 0 0 N007 0 AND
A487 0 N063 0 N062 0 0 N011 0 AND
A488 0 N068 0 N062 0 0 N015 0 AND
A489 0 N075 0 N062 0 0 N021 0 AND
A490 0 N081 0 N062 0 0 N026 0 AND
A491 0 N126 0 N062 0 0 N042 0 AND
A492 0 N128 0 N062 0 0 N048 0 AND
A493 0 N130 0 N062 0 0 N049 0 AND
A494 0 N135 0 N062 0 0 N053 0 AND
A495 0 N139 0 N062 0 0 N056 0 AND
A496 N190 N192 N690 N193 N191 0 N152 0 OR
A497 0 N038 0 N035 0 0 N301 0 AND
A498 N032 0 N027 0 N025 0 N295 0 OR
A499 N295 0 0 0 0 N298 0 0 BUF
A500 N301 0 0 0 N298 0 ctrl 0 AND
A501 0 N035 0 N027 0 0 N300 0 AND
A502 N038 0 N032 0 N025 0 N294 0 OR
A503 N294 0 0 0 0 N296 0 0 BUF
A504 N300 0 0 0 N296 0 N307 0 AND
A282 0 N060 0 ctrl 0 0 bit5 0 AND
A283 0 N063 0 ctrl 0 0 bit4 0 AND
A284 0 N068 0 ctrl 0 0 bit3 0 AND
A285 0 N075 0 ctrl 0 0 bit2 0 AND
A286 0 N081 0 ctrl 0 0 bit1 0 AND
A292 0 N621 0 N613 0 0 N509 0 AND
A293 0 N628 0 N613 0 0 N511 0 AND
A294 0 N639 0 N613 0 0 N517 0 AND
A295 0 N653 0 N613 0 0 N522 0 AND
A296 0 N667 0 N613 0 0 N530 0 AND
A302 0 N671 0 N613 0 0 N536 0 AND
A303 0 N094 0 N307 0 0 N341 0 AND
A304 0 N088 0 N307 0 0 N345 0 AND
A305 0 N080 0 N307 0 0 N349 0 AND
A306 0 N074 0 N307 0 0 N353 0 AND
A505 0 N055 0 N307 0 0 N203 0 AND
A506 0 N057 0 N307 0 0 N208 0 AND
A507 0 N058 0 N307 0 0 N213 0 AND
A508 0 N061 0 N307 0 0 N220 0 AND
A512 0 N105 N115 N118 N125 0 N156 0 AND
A513 0 N125 0 N111 0 0 N124 0 AND
A514 0 N118 0 N111 0 0 N117 0 AND
A515 0 N115 0 N111 0 0 N114 0 AND
A516 0 N105 0 N111 0 0 N104 0 AND
A517 N156 0 0 0 0 N157 0 0 BUF
A518 0 N152 0 N157 0 0 N062 0 OR
A509 0 N312 0 N307 0 0 N233 0 AND
V18 N001 0 PWL file="C:\Users\Angelo Apenkwah\Desktop\Projects\Logic processor\RausLang\DataLtspice\Bit1.txt"
V19 N125 0 PWL file="C:\Users\Angelo Apenkwah\Desktop\Projects\Logic processor\RausLang\DataLtspice\Bit2.txt"
V20 N118 0 PWL file="C:\Users\Angelo Apenkwah\Desktop\Projects\Logic processor\RausLang\DataLtspice\Bit3.txt"
V76 N115 0 PWL file="C:\Users\Angelo Apenkwah\Desktop\Projects\Logic processor\RausLang\DataLtspice\Bit4.txt"
V77 N105 0 PWL file="C:\Users\Angelo Apenkwah\Desktop\Projects\Logic processor\RausLang\DataLtspice\Bit5.txt"
V78 N025 0 PWL file="C:\Users\Angelo Apenkwah\Desktop\Projects\Logic processor\RausLang\DataLtspice\Bit6.txt"
V79 N027 0 PWL file="C:\Users\Angelo Apenkwah\Desktop\Projects\Logic processor\RausLang\DataLtspice\Bit7.txt"
V80 N032 0 PWL file="C:\Users\Angelo Apenkwah\Desktop\Projects\Logic processor\RausLang\DataLtspice\Bit8.txt"
V81 N035 0 PWL file="C:\Users\Angelo Apenkwah\Desktop\Projects\Logic processor\RausLang\DataLtspice\Bit9.txt"
V82 N038 0 PWL file="C:\Users\Angelo Apenkwah\Desktop\Projects\Logic processor\RausLang\DataLtspice\Bit10.txt"
V83 N002 0 PWL file="C:\Users\Angelo Apenkwah\Desktop\Projects\Logic processor\RausLang\DataLtspice\Bit11.txt"
V84 N094 0 PWL file="C:\Users\Angelo Apenkwah\Desktop\Projects\Logic processor\RausLang\DataLtspice\Bit12.txt"
V85 N088 0 PWL file="C:\Users\Angelo Apenkwah\Desktop\Projects\Logic processor\RausLang\DataLtspice\Bit13.txt"
V86 N080 0 PWL file="C:\Users\Angelo Apenkwah\Desktop\Projects\Logic processor\RausLang\DataLtspice\Bit14.txt"
V87 N074 0 PWL file="C:\Users\Angelo Apenkwah\Desktop\Projects\Logic processor\RausLang\DataLtspice\Bit15.txt"
V88 N055 0 PWL file="C:\Users\Angelo Apenkwah\Desktop\Projects\Logic processor\RausLang\DataLtspice\Bit16.txt"
V89 N057 0 PWL file="C:\Users\Angelo Apenkwah\Desktop\Projects\Logic processor\RausLang\DataLtspice\Bit17.txt"
V90 N058 0 PWL file="C:\Users\Angelo Apenkwah\Desktop\Projects\Logic processor\RausLang\DataLtspice\Bit18.txt"
V91 N061 0 PWL file="C:\Users\Angelo Apenkwah\Desktop\Projects\Logic processor\RausLang\DataLtspice\Bit19.txt"
V92 N312 0 PWL file="C:\Users\Angelo Apenkwah\Desktop\Projects\Logic processor\RausLang\DataLtspice\Bit20.txt"
V93 N003 0 PWL file="C:\Users\Angelo Apenkwah\Desktop\Projects\Logic processor\RausLang\DataLtspice\Bit21.txt"
V94 N341 0 PWL file="C:\Users\Angelo Apenkwah\Desktop\Projects\Logic processor\RausLang\DataLtspice\Bit22.txt"
V95 N345 0 PWL file="C:\Users\Angelo Apenkwah\Desktop\Projects\Logic processor\RausLang\DataLtspice\Bit23.txt"
V96 N349 0 PWL file="C:\Users\Angelo Apenkwah\Desktop\Projects\Logic processor\RausLang\DataLtspice\Bit24.txt"
V97 N353 0 PWL file="C:\Users\Angelo Apenkwah\Desktop\Projects\Logic processor\RausLang\DataLtspice\Bit25.txt"
X§X1 N386 N203 N409 ram_write_and_read_circuit
X§X2 N386 N208 N408 ram_write_and_read_circuit
X§X3 N386 N213 N407 ram_write_and_read_circuit
X§X4 N386 N220 N406 ram_write_and_read_circuit
X§X5 N386 N233 N405 ram_write_and_read_circuit
X§X6 N385 N203 N404 ram_write_and_read_circuit
X§X7 N385 N208 N403 ram_write_and_read_circuit
X§X8 N385 N213 N402 ram_write_and_read_circuit
X§X9 N385 N220 N401 ram_write_and_read_circuit
X§X10 N385 N233 N400 ram_write_and_read_circuit
X§X11 N383 N203 N434 ram_write_and_read_circuit
X§X12 N383 N208 N433 ram_write_and_read_circuit
X§X13 N383 N213 N432 ram_write_and_read_circuit
X§X14 N383 N220 N431 ram_write_and_read_circuit
X§X15 N383 N233 N430 ram_write_and_read_circuit
X§X16 N382 N203 N429 ram_write_and_read_circuit
X§X17 N382 N208 N428 ram_write_and_read_circuit
X§X18 N382 N213 N427 ram_write_and_read_circuit
X§X19 N382 N220 N426 ram_write_and_read_circuit
X§X20 N382 N233 N425 ram_write_and_read_circuit
X§X21 N379 N203 N424 ram_write_and_read_circuit
X§X22 N379 N208 N423 ram_write_and_read_circuit
X§X23 N379 N213 N422 ram_write_and_read_circuit
X§X24 N379 N220 N421 ram_write_and_read_circuit
X§X25 N379 N233 N420 ram_write_and_read_circuit
X§X26 N378 N203 N419 ram_write_and_read_circuit
X§X27 N378 N208 N418 ram_write_and_read_circuit
X§X28 N378 N213 N417 ram_write_and_read_circuit
X§X29 N378 N220 N416 ram_write_and_read_circuit
X§X30 N378 N233 N415 ram_write_and_read_circuit
X§X31 N377 N203 N414 ram_write_and_read_circuit
X§X32 N377 N208 N413 ram_write_and_read_circuit
X§X33 N377 N213 N412 ram_write_and_read_circuit
X§X34 N377 N220 N411 ram_write_and_read_circuit
X§X35 N377 N233 N410 ram_write_and_read_circuit
A510 0 N349 0 N345 0 0 N466 0 OR
A511 0 N466 0 N341 0 0 N463 0 OR
A519 N463 0 0 0 0 N462 0 0 BUF
A520 0 N353 0 N462 0 0 N386 0 AND
A521 0 N353 0 N345 0 0 N453 0 OR
A522 0 N453 0 N341 0 0 N451 0 OR
A523 N451 0 0 0 0 N450 0 0 BUF
A524 0 N349 0 N450 0 0 N385 0 AND
A525 0 N353 0 N349 0 0 N445 0 AND
A526 0 N345 0 N341 0 0 N443 0 OR
A527 N443 0 0 0 0 N442 0 0 BUF
A528 0 N445 0 N442 0 0 N383 0 AND
A529 0 N353 0 N349 0 0 N437 0 OR
A530 0 N437 0 N341 0 0 N436 0 OR
A531 N436 0 0 0 0 N435 0 0 BUF
A532 0 N345 0 N435 0 0 N382 0 AND
A533 0 N353 0 N345 0 0 N392 0 OR
A534 0 N392 0 N341 0 0 N391 0 OR
A535 N391 0 0 0 0 N390 0 0 BUF
A536 0 N349 0 N390 0 0 N379 0 AND
A537 0 N349 0 N345 0 0 N389 0 OR
A538 0 N389 0 N341 0 0 N388 0 OR
A539 N388 0 0 0 0 N387 0 0 BUF
A540 0 N353 0 N387 0 0 N378 0 AND
A541 0 N349 0 N345 0 0 N384 0 OR
A542 0 N384 0 N353 0 0 N381 0 OR
A543 N381 0 0 0 0 N380 0 0 BUF
A544 0 N341 0 N380 0 0 N377 0 AND

* block symbol definitions
.subckt ram_write_and_read_circuit Control value Read
S1 value Read Control 0 VSW
C1 Read 0 1µ
R1 0 value 100
.model VSW SW(Ron=.1 Roff=1000Gig Vt=0.9 Vh=0)
.ends ram_write_and_read_circuit

* output
.tran 0 10u 0 1n
* input 1
* input 2
* Adder Logic
* output
* Subtractor Logic
* input 1
* input 2
* input 1
* input 2
* Equality comparism
* input 1
* input 2
* Less than comparism
* input 1
* input 2
* Greater than comparism
* 00001 - add
* 00010 - sub
* 00011 - equ
* 00100 - less than
* 00101 - greater than
* 00110 - or
* 00111 - and
* 01000 - not
* Control data
* input 1
* input 2
* ALU
* output
* 0001
* 0010
* 0011
* 0100
* 0101
* 0110
* 0111
* 1000
* 1001
* 1010
* 1011
* 1100
* 1101
* 1110
* 1111
* Not
* And
* Or
* logic
* Arithmetic
* Command
* Parameter1
* Parameter2
* Parameter3
* output
* Condition
* Code Reader
* step cycle control
* Controlled with PWL file from DataLtspice Directory
* Generated from .raus code
* 00001 - add
* 00010 - sub
* 00011 - equ
* 00100 - less than
* 00101 - greater than
* 00110 - or
* 00111 - and
* 01000 - not
* 01001 - read
* 01010 - write
* 01011 - if
* Output
* RAM location Bit
* Value Bit
* Read
* Write
* Condition
* 5bit
* 4bit - ram location
* 5bit - for data
* 4bit
* 4bit
* 4bit
* Control Unit
* Output command
.save V(ctrl) V(bit1) V(bit2) V(bit3) V(bit4) V(bit5)
.backanno
.end